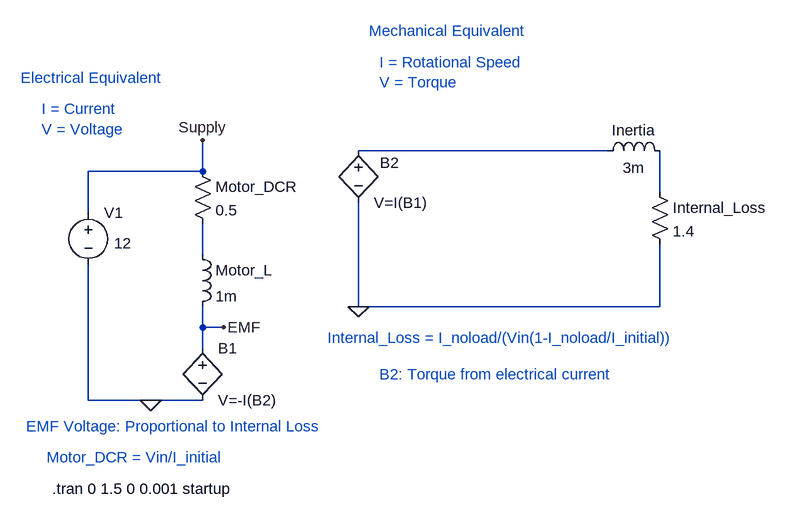
[diagram p0: schematic Motor sim NO softstart.asc]
Motor sim NO softstart.asc, the LTspice schematic file:
Version 4
SHEET 1 2136 680
WIRE 880 0 496 0
WIRE 256 32 256 -16
WIRE 256 32 80 32
WIRE 960 64 960 0
WIRE 80 96 80 32
WIRE 256 160 256 112
WIRE 496 240 496 80
WIRE 960 240 960 144
WIRE 960 240 496 240
WIRE 256 272 256 240
WIRE 288 272 256 272
WIRE 256 304 256 272
WIRE 80 384 80 176
WIRE 176 384 80 384
WIRE 256 384 176 384
FLAG 288 272 EMF
FLAG 256 -16 Supply
FLAG 496 240 0
FLAG 176 384 0
SYMBOL voltage 80 80 R0
WINDOW 3 40 63 Left 2
WINDOW 123 0 0 Left 0
WINDOW 39 0 0 Left 0
SYMATTR Value 12
SYMATTR InstName V1
SYMBOL res 240 16 R0
SYMATTR InstName Motor_DCR
SYMATTR Value 0.5
SYMBOL res 944 48 R0
SYMATTR InstName Internal_Loss
SYMATTR Value 1.4
SYMBOL bv 256 288 R0
SYMATTR InstName B1
SYMATTR Value V=-I(B2)
SYMBOL bv 496 -16 R0
WINDOW 0 33 35 Left 2
SYMATTR InstName B2
SYMATTR Value V=I(B1)
SYMBOL ind 240 144 R0
SYMATTR InstName Motor_L
SYMATTR Value 1m
SYMBOL ind 864 16 R270
WINDOW 0 32 56 VTop 2
WINDOW 3 5 56 VBottom 2
SYMATTR InstName Inertia
SYMATTR Value 3m
TEXT -24 -112 Left 2 ;Electrical Equivalent
TEXT 512 -184 Left 2 ;Mechanical Equivalent
TEXT 8 -64 Left 2 ;I = Current\nV = Voltage
TEXT 528 -136 Left 2 ;I = Rotational Speed\nV = Torque
TEXT 16 472 Left 2 ;Motor_DCR = Vin/I_initial
TEXT 448 288 Left 2 ;Internal_Loss = I_noload/(Vin(1-I_noload/I_initial))
TEXT 24 520 Left 2 !.tran 0 1.5 0 0.001 startup
TEXT -16 424 Left 2 ;EMF Voltage: Proportional to Internal Loss
TEXT 528 344 Left 2 ;B2: Torque from electrical current

The netlist it stands for:
* Motor sim NO softstart.asc
V1 Supply 0 12
R§Motor_DCR Supply N003 0.5
R§Internal_Loss N002 0 1.4
B1 EMF 0 V=-I(B2)
B2 N001 0 V=I(B1)
L§Motor_L N003 EMF 1m
L§Inertia N001 N002 3m
* Electrical Equivalent
* Mechanical Equivalent
* I = Current
* V = Voltage
* I = Rotational Speed
* V = Torque
* Motor_DCR = Vin/I_initial
* Internal_Loss = I_noload/(Vin(1-I_noload/I_initial))
.tran 0 1.5 0 0.001 startup
* EMF Voltage: Proportional to Internal Loss
* B2: Torque from electrical current
.backanno
.end

* Results of the author's LTspice run, read from the files saved beside the schematic
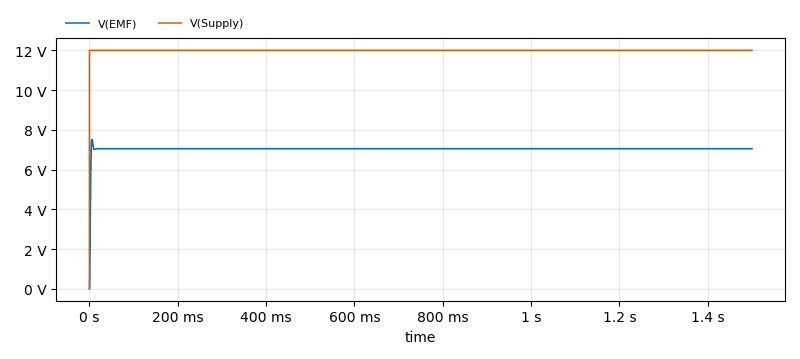
[diagram p1: Transient Analysis of Motor sim NO softstart.asc, plotted from the saved traces]
* Transient Analysis, 1 run:
*   V(EMF): min 0 V, max 7.512 V, average 7.043 V, rms 7.046 V, last 7.051 V
*   V(Supply): min 0 V, max 12 V, average 12 V, rms 12 V, last 12 V